# EAGLE design seguidor LDR_12 (EAGLE 7.2.0)
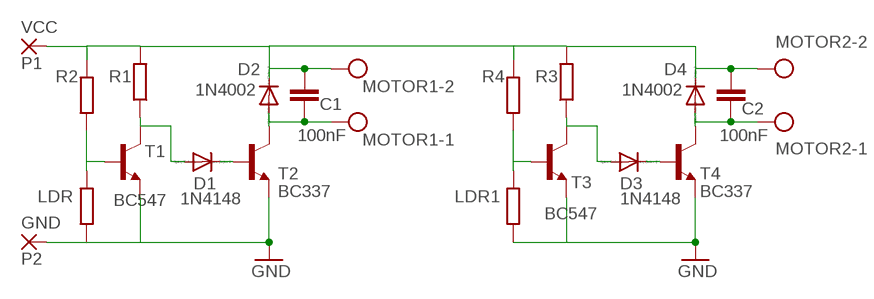
[diagram p0: schematic, sheet 1]

## Parts
C1  100nF  C-EU050-025X075  [C050-025X075]
C2  100nF  C-EU050-025X075  [C050-025X075]
D1  1N4148  1N4148DO35-10  [DO35-10]
D2  1N4002  1N4004  [DO41-10]
D3  1N4148  1N4148DO35-10  [DO35-10]
D4  1N4002  1N4004  [DO41-10]
GND  P2  WIREPAD2,15/1,0  [2,15/1,0]
LDR  R-EU_0204/5  [0204/5]
LDR1  R-EU_0204/5  [0204/5]
MOTOR1  AK500/2  [AK500/2]
MOTOR2  AK500/2  [AK500/2]
R1  R-EU_0207/10  [0207/10]
R2  R-EU_0207/10  [0207/10]
R3  R-EU_0207/10  [0207/10]
R4  R-EU_0207/10  [0207/10]
T1  BC547  BC337-16-NPN-TO92-CBE  [TO92-CBE]
T2  BC337  BC337-16-NPN-TO92-CBE  [TO92-CBE]
T3  BC547  BC337-16-NPN-TO92-CBE  [TO92-CBE]
T4  BC337  BC337-16-NPN-TO92-CBE  [TO92-CBE]
VCC  P1  WIREPAD2,15/1,0  [2,15/1,0]

## Nets
GND: GND.1(P) LDR1.1 LDR.1 T1.E T2.E T3.E T4.E
N$1: LDR.2 R2.1 T1.B
N$3: LDR1.2 R4.1 T3.B
N$4: C1.1 C2.1 D2.C D4.C MOTOR1.2 MOTOR2.2 R1.2 R2.2 R3.2 R4.2 VCC.1(P)
N$5: D3.A R3.1 T3.C
N$6: D1.A R1.1 T1.C
N$7: D1.C T2.B
N$8: C1.2 D2.A MOTOR1.1 T2.C
N$9: D3.C T4.B
N$10: C2.2 D4.A MOTOR2.1 T4.C

## Library data of the parts
C1 C2 = rcl:C-EU: CAPACITOR, European symbol
D1 D3 = diode:1N4148: DIODE high speed (Philips)
D2 D4 = diode:1N4004: DIODE general purpose rectifier, 1 A
GND VCC = wirepad:WIREPAD: Wire PAD connect wire on PCB
LDR LDR1 R1-R4 = resistor:R-EU_: RESISTOR, European symbol
MOTOR1 MOTOR2 = con-ptr500:AK500/2: CONNECTOR; OC_FARNELL: unknown; OC_NEWARK: unknown
T1-T4 = transistor:*-NPN-: NPN Transistror BF959 corrected 2008.03.06

## Board
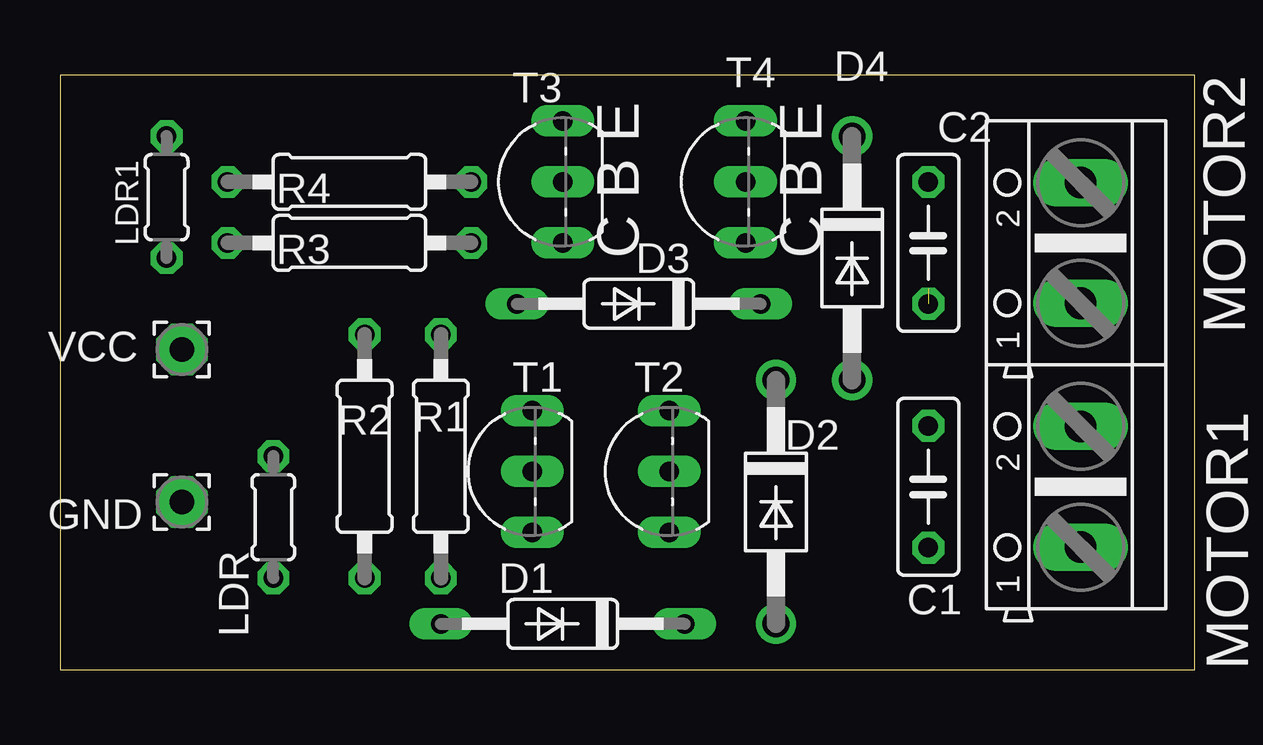
[diagram p1: board, top side]
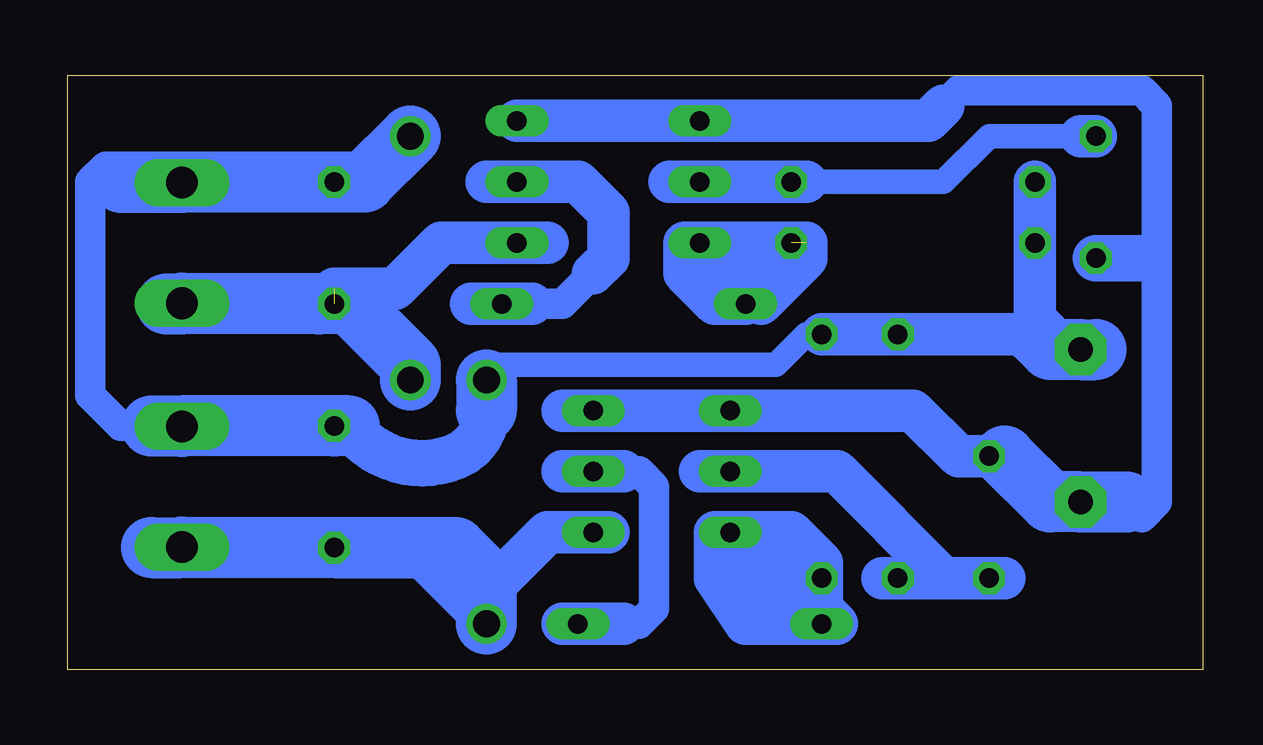
[diagram p2: board, bottom side, seen from below]

Size 47.3 x 24.76 mm. Coordinates in mm from the lower left corner, seen from the top.
Outline: 0,0 47.3,0 47.3,24.76 0,24.76 0,0
Copper layers (1*16): Top 0.035mm / dielectric 1.5mm / Bottom 0.035mm
Design rules "default": minimum track width 10mil, minimum drill 24mil, track to track 8mil, track to pad 8mil, pad to pad 8mil, via to via 8mil, smd to smd 8mil, copper to edge 40mil, drill to drill 8mil, minimum pad ring 10mil, minimum via ring 8mil, stop-mask expansion 4mil, vias tented up to drill 0mil, thermal gap 10mil

### Footprints (pad centres in the part's own frame; a part is rotated, then mirrored left to right if it is on the bottom)
C050-025X075 = drill 0.813 octagon: 1 -2.54,0; 2 2.54,0
DO35-10 = drill 0.813 long: A 5.08,0; C -5.08,0
DO41-10 = drill 1.118: A 5.08,0; C -5.08,0
2,15/1,0 = drill 1.016 pad 2.159 octagon: 1 0,0
0204/5 = drill 0.813 octagon: 1 -2.54,0; 2 2.54,0
AK500/2 = drill 1.321 long: 1 -2.515,0; 2 2.515,0
0207/10 = drill 0.813 octagon: 1 -5.08,0; 2 5.08,0
TO92-CBE = drill 0.813 long: B 0,0; C -2.54,0; E 2.54,0

### Placement (x,y rotation side)
C1  36.2,7.62 270 top
C2  36.2,17.78 270 top
D1  20.96,1.91 180 top
D2  29.84,6.98 270 top
D3  24.13,15.24 180 top
D4  33.02,17.15 270 top
GND  5.08,6.98 0 top
LDR  8.89,6.35 270 top
LDR1  4.44,19.69 90 top
MOTOR1  42.55,7.62 90 top
MOTOR2  42.55,17.78 90 top
R1  15.88,8.89 90 top
R2  12.7,8.89 90 top
R3  12.07,17.78 180 top
R4  12.07,20.32 180 top
T1  19.69,8.25 90 top
T2  25.4,8.25 90 top
T3  20.96,20.32 90 top
T4  28.58,20.32 90 top
VCC  5.08,13.34 0 top

### Tracks (layer width: path | path; a pad name or v marks a point on that pad's centre or on a via)
GND
  Bottom 1.27: 2.54,17.15 1.91,16.51 | 1.91,16.51 1.91,15.88 1.91,6.98 2.54,6.35 3.17,6.98 | 10.8,23.49 10.16,24.13 2.54,24.13 1.91,23.49 1.91,16.51
  Bottom 1.778: T4.E T3.E 11.43,22.86 10.8,23.49 | 26.67,10.79 T2.E T1.E 12.07,10.79 10.16,8.89 LDR.1 8.25,8.89
  Bottom 1.93: LDR1.1 2.54,17.15
  Bottom 2.54: 3.17,6.98 GND.1 6.35,6.98 8.25,8.89
N$1
  Bottom 1.778: 20.96,8.25 T1.B 15.24,8.25 10.8,3.81 | 10.8,3.81 LDR.2 8.25,3.81 | 13.34,3.81 R2.1 10.8,3.81
N$3
  Bottom 1.016: 5.08,22.23 8.89,22.23 10.8,20.32 16.51,20.32
  Bottom 1.778: 22.23,20.32 T3.B R4.1 16.51,20.32 | LDR1.2 5.08,22.23
N$4
  Bottom 1.016: D2.C 29.21,12.7 17.78,12.7 16.51,13.97 R1.2
  Bottom 1.27: 42.57,10.16 45.09,10.16 46.36,11.43 46.36,20.32 45.72,20.95 44.45,20.95 43.81,20.32
  Bottom 1.778: R4.2 R3.2 6.99,14.6 5.71,13.34 | R1.2 R2.2 6.99,13.97
  Bottom 1.93: 29.84,10.79 arc67 31.12,8.89 arc77 35.56,10.16
  Bottom 2.54: D2.C 29.84,10.79 | 35.56,10.16 C1.1 42.57,10.16 | 43.81,10.16 42.57,10.16 | 42.57,10.16 MOTOR1.2 | 4.44,13.34 VCC.1 5.71,13.34 6.35,13.34 6.99,13.97 | MOTOR2.2 45.06,20.3 45.09,20.32 43.81,20.32 C2.1 34.92,20.32 D4.C
N$5  (1 unrouted)
  Bottom 1.778: D3.A 20.32,15.24 21.59,16.51 21.59,17.78 T3.C | T3.C 16.51,17.78 16.51,17.15 18.41,15.24 18.41,16.51 20.32,16.51 20.32,17.15 T3.C
N$6
  Bottom 1.778: 19.05,5.71 17.14,5.71 15.88,4.45 R1.1 15.88,2.54 | 17.14,1.91 19.05,1.91 20.32,3.81 20.32,5.71 T1.C 19.05,5.71 | D1.A 15.24,1.91 15.88,2.54 | D1.A 17.14,1.91 | 17.14,1.91 20.32,5.08 18.41,5.08 17.78,4.45 17.78,3.81 D1.A | 15.88,2.54 19.05,5.71
N$7
  Bottom 1.27: 24.13,1.91 23.5,1.91 22.86,2.54 22.86,7.62 23.5,8.25 24.13,8.25
  Bottom 1.778: 26.67,1.91 D1.C 24.13,1.91 | 24.13,8.25 T2.B 26.67,8.25
N$8
  Bottom 1.778: 24.77,5.71 T2.C 27.3,5.71 29.84,3.18 29.84,2.54
  Bottom 2.54: D2.A 29.84,2.54 | 29.84,2.54 29.84,3.81 31.12,5.08 C1.2 | C1.2 42.57,5.08 | 43.81,5.08 42.57,5.08 | 42.57,5.08 MOTOR1.1 | C1.2 32.38,5.08 29.84,2.54
N$9
  Bottom 1.27: 25.4,16.51 26.67,15.24 27.94,15.24
  Bottom 1.778: 29.84,20.32 T4.B 26.04,20.32 24.77,19.05 24.77,17.15 25.4,16.51 | 27.94,15.24 D3.C 30.48,15.24
N$10  (1 unrouted)
  Bottom 1.778: 27.3,17.78 T4.C 31.75,17.78 33.66,15.88 36.2,15.88 36.83,15.24
  Bottom 2.54: D4.A 33.02,12.7 35.56,15.24 36.83,15.24 42.57,15.24 | 43.18,15.24 42.57,15.24 | 42.57,15.24 MOTOR2.1

### Text on the board
tPlace: C B E | C B E